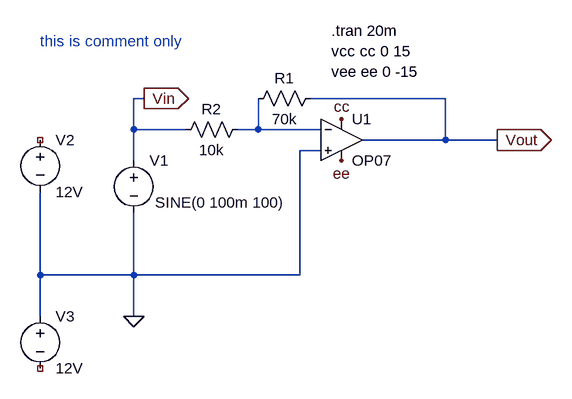
[diagram p0: schematic learn_opa1.asc]
learn_opa1.asc, the LTspice schematic file:
Version 4
SHEET 1 880 724
WIRE -80 240 -96 240
WIRE 384 240 176 240
WIRE -96 288 -96 240
WIRE -16 288 -96 288
WIRE 96 288 96 240
WIRE 96 288 64 288
WIRE 192 288 96 288
WIRE 384 304 384 240
WIRE 384 304 256 304
WIRE 464 304 384 304
WIRE 192 320 160 320
WIRE -96 336 -96 288
WIRE -240 512 -240 384
WIRE -96 512 -96 416
WIRE -96 512 -240 512
WIRE 160 512 160 320
WIRE 160 512 -96 512
WIRE -240 576 -240 512
WIRE -96 576 -96 512
FLAG 464 304 Vout
IOPIN 464 304 Out
FLAG -80 240 Vin
IOPIN -80 240 Out
FLAG -96 576 0
FLAG 224 272 cc
FLAG 224 336 ee
SYMBOL OpAmps/OP07 224 240 R0
SYMATTR InstName U1
SYMBOL voltage -96 320 R0
WINDOW 3 33 80 Left 2
SYMATTR InstName V1
SYMATTR Value SINE(0 100m 100)
SYMBOL res 80 272 R90
WINDOW 0 0 56 VBottom 2
WINDOW 3 32 56 VTop 2
SYMATTR InstName R2
SYMATTR Value 10k
SYMBOL res 192 224 R90
WINDOW 0 0 56 VBottom 2
WINDOW 3 32 56 VTop 2
SYMATTR InstName R1
SYMATTR Value 70k
SYMBOL voltage -240 288 R0
SYMATTR InstName V2
SYMATTR Value 12V
SYMBOL voltage -240 560 R0
SYMATTR InstName V3
SYMATTR Value 12V
TEXT 208 136 Left 2 !.tran 20m\nvcc cc 0 15\nvee ee 0 -15
TEXT -240 152 Left 2 ;this is comment only

The netlist it stands for:
* learn_opa1.asc
XU1 0 N001 cc ee Vout LT1001  ; OP07, pins In+ In- V+ V- OUT
V1 Vin 0 SINE(0 100m 100)
R2 N001 Vin 10k
R1 Vout N001 70k
V2 NC_01 0 12V
V3 0 NC_02 12V
.tran 20m
vcc cc 0 15
vee ee 0 -15
* this is comment only
.lib LTC.lib
.backanno
.end